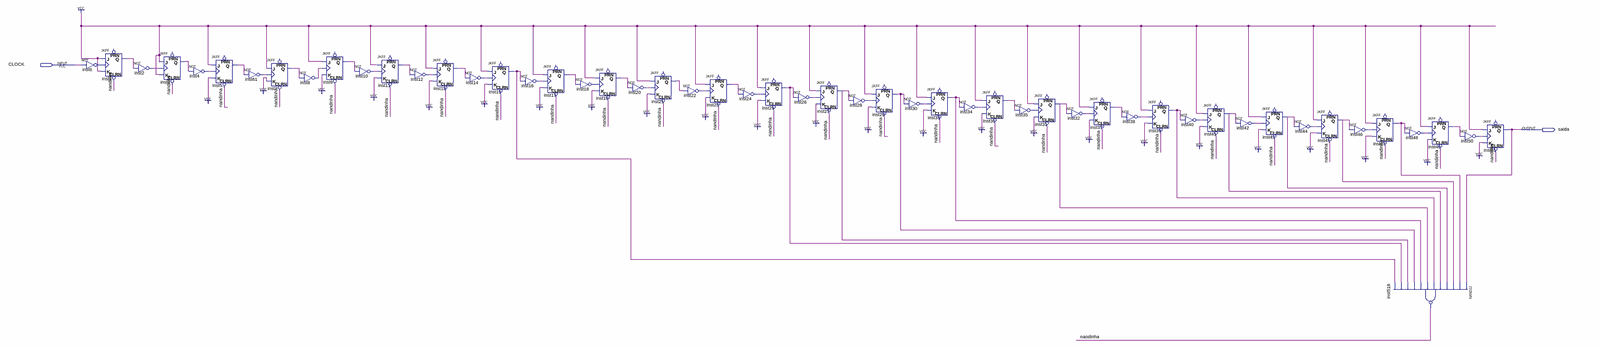
[diagram p0: schematic sheet, whole]
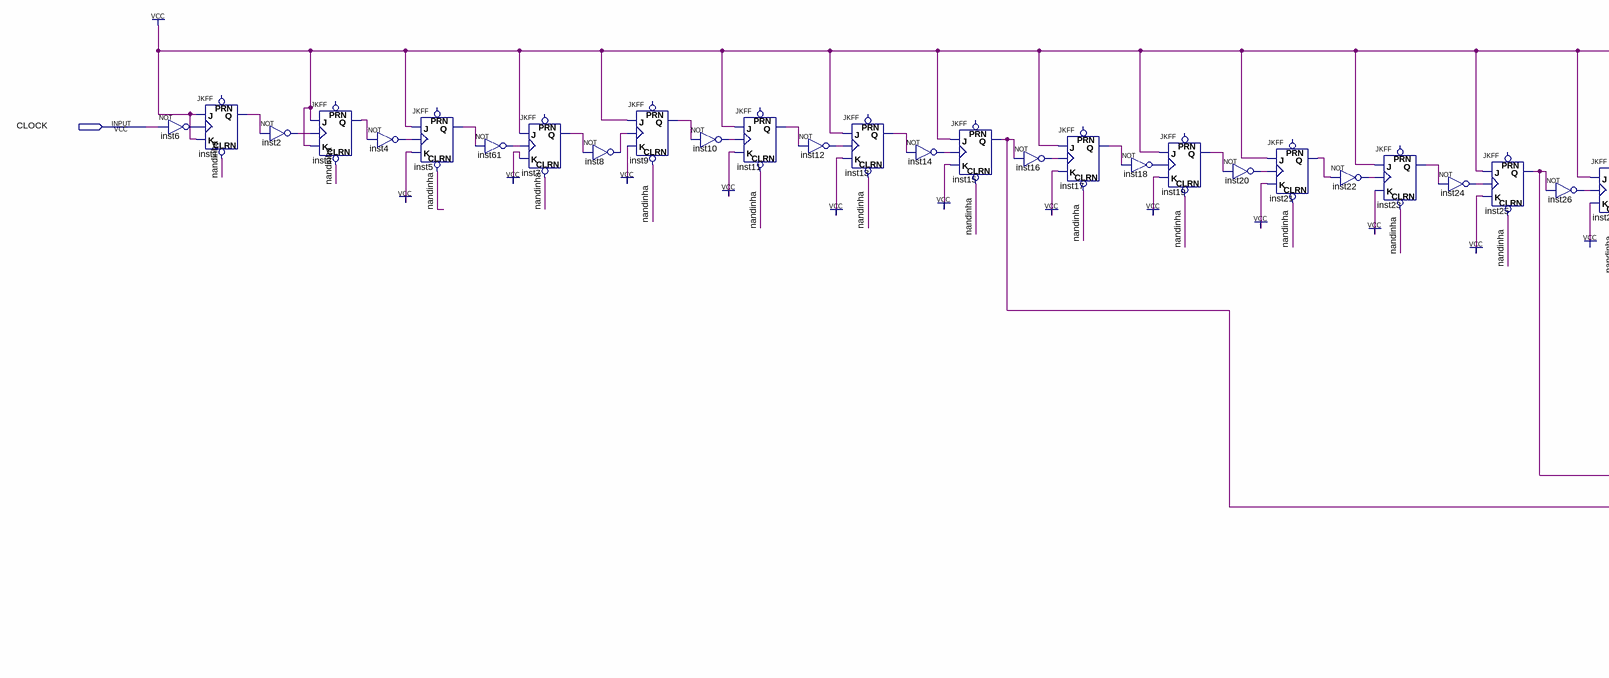
[diagram p1: schematic sheet, left part]
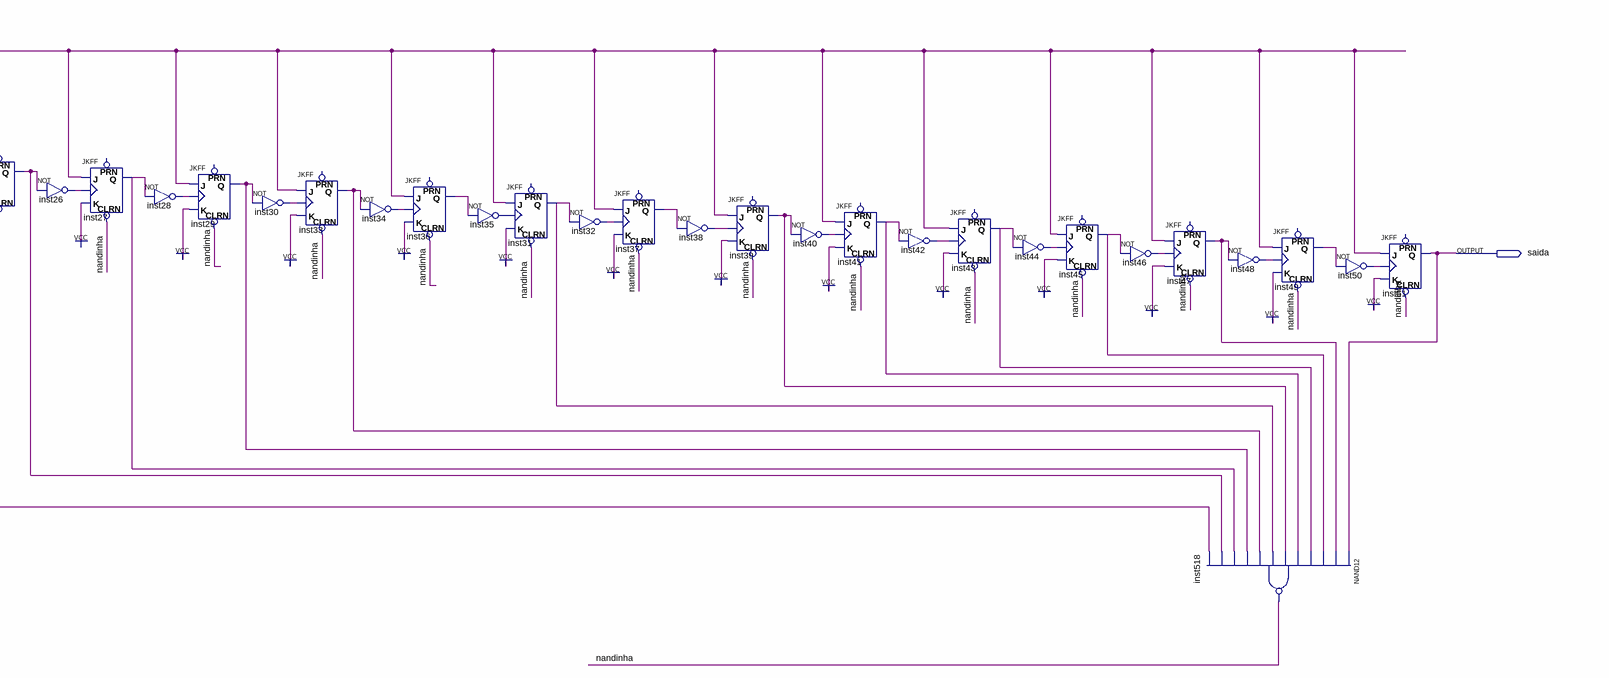
[diagram p2: schematic sheet, right part]
// Quartus schematic divfreq.bdf as structural Verilog: 53 symbols, 2 pins
module divfreq (
  input  CLOCK,
  output saida
);

  wire inst1_q, inst2_out, inst3_q, inst4_out, inst5_q, inst6_out, inst7_q, inst8_out, inst9_q, inst10_out,
       inst11_q, inst12_out, inst13_q, inst14_out, inst15_q, inst16_out, inst17_q, inst18_out, inst19_q,
       inst20_out, inst21_q, inst22_out, inst23_q, inst24_out, inst25_q, inst26_out, inst27_q, inst28_out,
       inst29_q, inst30_out, inst31_q, inst32_out, inst33_q, inst34_out, inst35_out, inst36_q, inst37_q,
       inst38_out, inst39_q, inst40_out, inst41_q, inst42_out, inst43_q, inst44_out, inst45_q, inst46_out,
       inst47_q, inst48_out, inst49_q, inst50_out, inst61_out, nandinha;

  JKFF inst1 (.CLRN(nandinha), .K(1'b1), .J(1'b1), .CLK(inst6_out), .Q(inst1_q));  // open: PRN
  not inst6 (inst6_out, CLOCK);
  not inst2 (inst2_out, inst1_q);
  JKFF inst3 (.CLRN(nandinha), .K(1'b1), .J(1'b1), .CLK(inst2_out), .Q(inst3_q));  // open: PRN
  not inst4 (inst4_out, inst3_q);
  JKFF inst5 (.CLRN(nandinha), .K(1'b1), .J(1'b1), .CLK(inst4_out), .Q(inst5_q));  // open: PRN
  not inst61 (inst61_out, inst5_q);
  JKFF inst7 (.CLRN(nandinha), .K(1'b1), .J(1'b1), .CLK(inst61_out), .Q(inst7_q));  // open: PRN
  not inst8 (inst8_out, inst7_q);
  JKFF inst9 (.CLRN(nandinha), .K(1'b1), .J(1'b1), .CLK(inst8_out), .Q(inst9_q));  // open: PRN
  not inst10 (inst10_out, inst9_q);
  JKFF inst11 (.CLRN(nandinha), .K(1'b1), .J(1'b1), .CLK(inst10_out), .Q(inst11_q));  // open: PRN
  not inst12 (inst12_out, inst11_q);
  JKFF inst13 (.CLRN(nandinha), .K(1'b1), .J(1'b1), .CLK(inst12_out), .Q(inst13_q));  // open: PRN
  not inst14 (inst14_out, inst13_q);
  JKFF inst15 (.CLRN(nandinha), .K(1'b1), .J(1'b1), .CLK(inst14_out), .Q(inst15_q));  // open: PRN
  JKFF inst17 (.CLRN(nandinha), .K(1'b1), .J(1'b1), .CLK(inst16_out), .Q(inst17_q));  // open: PRN
  not inst16 (inst16_out, inst15_q);
  JKFF inst19 (.CLRN(nandinha), .K(1'b1), .J(1'b1), .CLK(inst18_out), .Q(inst19_q));  // open: PRN
  not inst18 (inst18_out, inst17_q);
  not inst20 (inst20_out, inst19_q);
  JKFF inst21 (.CLRN(nandinha), .K(1'b1), .J(1'b1), .CLK(inst20_out), .Q(inst21_q));  // open: PRN
  not inst22 (inst22_out, inst21_q);
  JKFF inst23 (.CLRN(nandinha), .K(1'b1), .J(1'b1), .CLK(inst22_out), .Q(inst23_q));  // open: PRN
  not inst24 (inst24_out, inst23_q);
  JKFF inst25 (.CLRN(nandinha), .K(1'b1), .J(1'b1), .CLK(inst24_out), .Q(inst25_q));  // open: PRN
  not inst26 (inst26_out, inst25_q);
  JKFF inst27 (.CLRN(nandinha), .K(1'b1), .J(1'b1), .CLK(inst26_out), .Q(inst27_q));  // open: PRN
  not inst28 (inst28_out, inst27_q);
  JKFF inst29 (.CLRN(nandinha), .K(1'b1), .J(1'b1), .CLK(inst28_out), .Q(inst29_q));  // open: PRN
  not inst30 (inst30_out, inst29_q);
  JKFF inst33 (.CLRN(nandinha), .K(1'b1), .J(1'b1), .CLK(inst30_out), .Q(inst33_q));  // open: PRN
  not inst34 (inst34_out, inst33_q);
  JKFF inst36 (.CLRN(nandinha), .K(1'b1), .J(1'b1), .CLK(inst34_out), .Q(inst36_q));  // open: PRN
  JKFF inst31 (.CLRN(nandinha), .K(1'b1), .J(1'b1), .CLK(inst35_out), .Q(inst31_q));  // open: PRN
  not inst35 (inst35_out, inst36_q);
  JKFF inst37 (.CLRN(nandinha), .K(1'b1), .J(1'b1), .CLK(inst32_out), .Q(inst37_q));  // open: PRN
  not inst32 (inst32_out, inst31_q);
  not inst38 (inst38_out, inst37_q);
  JKFF inst39 (.CLRN(nandinha), .K(1'b1), .J(1'b1), .CLK(inst38_out), .Q(inst39_q));  // open: PRN
  not inst40 (inst40_out, inst39_q);
  JKFF inst41 (.CLRN(nandinha), .K(1'b1), .J(1'b1), .CLK(inst40_out), .Q(inst41_q));  // open: PRN
  not inst42 (inst42_out, inst41_q);
  JKFF inst43 (.CLRN(nandinha), .K(1'b1), .J(1'b1), .CLK(inst42_out), .Q(inst43_q));  // open: PRN
  not inst44 (inst44_out, inst43_q);
  JKFF inst45 (.CLRN(nandinha), .K(1'b1), .J(1'b1), .CLK(inst44_out), .Q(inst45_q));  // open: PRN
  not inst46 (inst46_out, inst45_q);
  JKFF inst47 (.CLRN(nandinha), .K(1'b1), .J(1'b1), .CLK(inst46_out), .Q(inst47_q));  // open: PRN
  nand inst518 (nandinha, saida, inst47_q, inst45_q, inst43_q, inst41_q, inst39_q, inst31_q, inst33_q, inst29_q, inst27_q, inst25_q, inst15_q);
  JKFF inst49 (.CLRN(nandinha), .K(1'b1), .J(1'b1), .CLK(inst48_out), .Q(inst49_q));  // open: PRN
  not inst48 (inst48_out, inst47_q);
  not inst50 (inst50_out, inst49_q);
  JKFF inst51 (.CLRN(nandinha), .K(1'b1), .J(1'b1), .CLK(inst50_out), .Q(saida));  // open: PRN
endmodule
